# Altium project RCA.PrjPcb
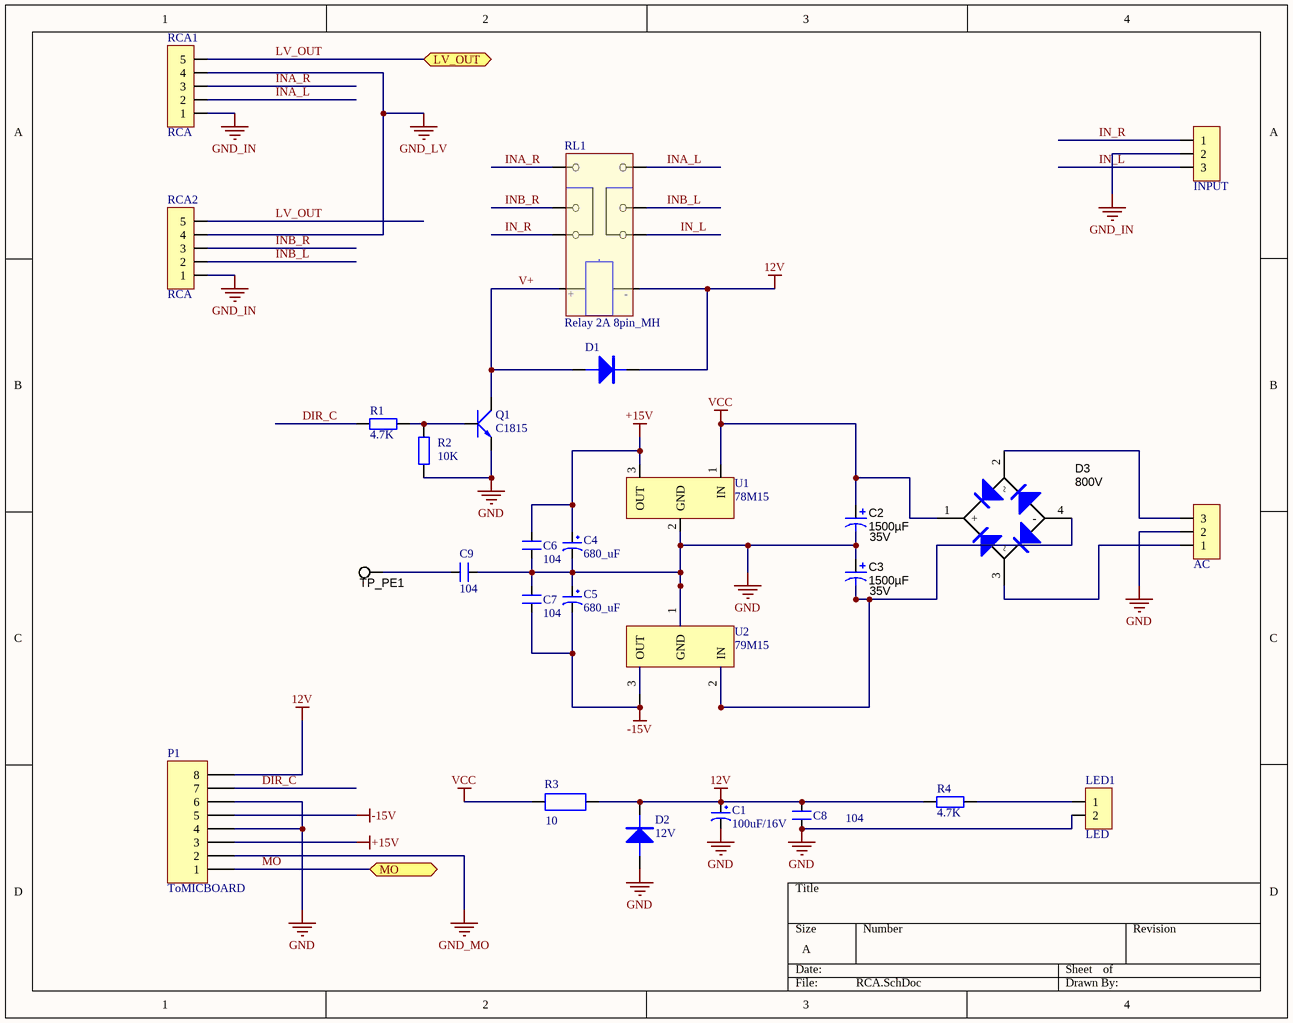
[diagram p0: RCA.SchDoc]
3 sheets, 80 parts. Net scope: flat (ports and power ports of the same name join across sheets).
Board file: PCB1.PcbDoc
Sheets:
  RCA.SchDoc
  outputmixer.SchDoc
  livestream.SchDoc

## Sheet RCA.SchDoc
size A

### Parts
AC  Header 3_MH  [HEADER 3]  (value not drawn)
C1  100uF/16V  [NHG_1000x2200]
C2  ValueDisplayed: 1500µF  Value2: 35V  [FC_1250x2500]  (hidden comment: ELZA350ELL152MK25S)
C3  ValueDisplayed: 1500µF  Value2: 35V  [FC_1250x2500]  (hidden comment: ELZA350ELL152MK25S)
C4  680_uF  [NHG_1000x2200]
C5  680_uF  [NHG_1000x2200]
C6  104  [TU_GOM(104-->105pF)]
C7  104  [TU_GOM(104-->105pF)]
C8  104  [TU_GOM(104-->105pF)]
C9  104  [TU_GOM(104-->105pF)]
D1  Diode 1N4001 DO41 1A 50V (DIP)_MH  [SS14]  (value not drawn)
D2  12V  [Diode Zener 1N5359B 5W 24V]
D3  value 800V  [GBU]  (hidden comment: GBU4K-E3/45)
INPUT  Header 3_MH  [HEADER 3]  (value not drawn)
LED1  LED  [HEADER 2]
P1  ToMICBOARD  [HEADER2M_8P]
Q1  C1815  [TO92]
R1  4.7K  [TRO_VACH_ 1/4W]
R2  10K  [TRO_VACH_ 1/4W]
R3  value 10  [TRO_VACH_2W]  (hidden comment: TRO_CS_2W_MH)
R4  4.7K  [TRO_VACH_ 1/4W]
RCA1  RCA  [RCA3P]
RCA2  RCA  [RCA3P]
RL1  Relay 2A 8pin_MH  [RY-12W-K 12V]
TP_PE1  5012  [Keystone5012]  (value not drawn)
U1  78M15  [TO-220AB]
U2  79M15  [TO-220AB]

### Ports
LV_OUT, MO

### Nets
12V: C1.1 C8.2 D1.2 D2.2 P1.8 R3.2 R4.1 RL1.2
+15V: C4.1 C6.2 P1.3 U1.3(OUT)
-15V: C5.2 C7.1 P1.5 U2.3(OUT)
GND: AC.2 C1.2 C2.2(-) C3.1(+) C4.2 C5.1 C6.1 C7.2 C8.1 C9.1 D2.1 LED1.2 P1.4 P1.6 Q1.1(E) R2.1 RCA1.4 RCA2.4 U1.2(GND) U2.1(GND)  [also labelled GND_LV]
GND_IN: INPUT.2 RCA1.1 RCA2.1
GND_MO: P1.2
VCC: C2.1(+) D3.1(+) R3.1 U1.1(IN)
DIR_C: P1.7 R1.1
IN_L: INPUT.3 RL1.4
IN_R: INPUT.1 RL1.3
INA_L: RCA1.2 RL1.8
INA_R: RCA1.3 RL1.7
INB_L: RCA2.2 RL1.6
INB_R: RCA2.3 RL1.5
LV_OUT: RCA1.5 RCA2.5 ; port LV_OUT
MO: P1.1 ; port MO
V+: D1.1 Q1.2(C) RL1.1
NetAC_1: AC.1 D3.3
NetAC_3: AC.3 D3.2
NetC3_2: C3.2(-) D3.4(-) U2.2(IN)
NetC9_2: C9.2 TP_PE1.1
NetLED1_1: LED1.1 R4.2
NetQ1_3: Q1.3(B) R1.2 R2.2

### Notes on the sheet
- (in symbol Relay 2A 8pin_MH) +; -

### Library data of the parts
AC INPUT = Header 3_MH: Header 3P XH2.54 thẳng
C1 = TU_HOA_100uF_16V_MH: TU_HOA_100uF_16V; Value: 100uF/35V/50V; Description 1: 1000uF/6,3V - 470uF/16V - 330uF - 25V; Description 2: 220uF/35V - 100uF/50V - 63V - 4,7uF/200V; Description 3: 22uF => 33uF100V - 3,3uF => 4,7uF/250V; Description 4: 2,2uF =>3,3uF/350 - 2,2uF/400V - 1uF/450V
C2 C3 = EEU-FC1H561: CAP ALUM 1500UF 20% 35V RADIAL; Manufacturer: Panasonic; Polarized: Y; CompType: Capacitor; U/M: EA; Cap_F: 0.00056; Tolerance_%: 20; Value1: 0.05 ohm; VDC_V: 35; ESR_ohm: 0.05; IRMS_A: 1.832; TaMin_C: -55; TaMax_C: 105; Cap_Case: 12.5x25mm; SymbolVersion: 2008-07-09; Value: 1500uF; PartNumber: ELZA350ELL152MK25S; PackageReference: D12.5xL25mm; RoHS: Y; MountType: TH; Technology: AL; Series: FC; Publisher: Texas Instruments; LatestRevisionDate: 2015-07-24; ComponentLink1Description: Datasheet link; ComponentLink1URL: http://industrial.panasonic.com/lecs/www-data/pdf/ABA0000/ABA0000CE22.pdf; Supplier 1: Digi-Key; Supplier 2: Mouser; Supplier Part Number 2: 565-3374-ND
C4 C5 = TU_HOA_680_uF_25V_MH: TU_HOA_680_uF_25V; Value: 100uF/35V/50V; Description 1: 1000uF/6,3V - 470uF/16V - 330uF - 25V; Description 2: 220uF/35V - 100uF/50V - 63V - 4,7uF/200V; Description 3: 22uF => 33uF100V - 3,3uF => 4,7uF/250V; Description 4: 2,2uF =>3,3uF/350 - 2,2uF/400V - 1uF/450V
C6-C9 = TU_MICA_ 104 100V(2A104J)_MH: Value: 0.1uF
D1 = Diode 1N4001 DO41 1A 50V (DIP)_MH: Diode 1N4001 DO41 1A 50V (DIP)
D2 = Diode 1N4148 DO35 450mA 100V ( 1N4148 DIP)_MH: Diode 1N4148 DO35 450mA 100V ( 1N4148 DIP)
D3 = GBU4K-E3/45: Diode, Switching-Bridge, 800V, 4A, TH; Manufacturer: Vishay-Semiconductor; U/M: EA; Vf_V: 1; Value2: 1V; Io_A: 4; Vr_V: 800; TJmax_C: 150; RJC_CperW: 4.2; RoHS: Y; Supplier 1: Digi-Key; PackageReference: GBU; Type: Switching-Bridge; Supplier Part Number 1: GBU4K-E3/45GI-ND; MountType: TH; PartNumber: GBU4K-E3/45; CompType: Diode; SymbolVersion: 2009-10-05; Value1: 4A; Published: 2008-06-26; Publisher: Texas Instruments; LatestRevisionDate: 2013-12-05; ComponentLink1Description: Datasheet link; ComponentLink1URL: http://www.vishay.com/docs/88614/gbu4a.pdf; Supplier 2: Mouser; Supplier Part Number 2: 625-GBU4K-E3; Supplier 3: Farnell; Supplier Part Number 3: 9549463
LED1 = Header 2_MH: Header 2P XH2.54 thẳng
P1 = Header 8: Header, 8-Pin; LatestRevisionDate: 17-Jul-2002; LatestRevisionNote: Re-released for DXP Platform.; Publisher: Altium Limited
Q1 = C1815 TO92 TRANS NPN 0.15A 50V (DIP)_MH
R1 R2 R4 = TRO_VACH_1/2W_MH: Resistor; Value: 1K; Published: 8-Jun-2000; LatestRevisionDate: 17-Jul-2002; LatestRevisionNote: Re-released for DXP Platform.; Publisher: Altium Limited
RCA1 RCA2 = Header 5_MH: Header 5P XH2.54 thẳng
RL1 = Relay 2A 8pin_MH: rele 2A
TP_PE1 = 5012: Test Point, Multipurpose, White, TH; Manufacturer: Keystone; CompType: Test Point Loop; ContactFinish: Silver; SymbolVersion: 2008-04-04; PartNumber: 5012; PackageReference: White Multipurpose Testpoint; RoHS: Y; MountType: TH; ComponentLink1Description: Datasheet URL; ComponentLink1URL: http://www.keyelco.com/userAssets/file/M60-2p60.pdf; Color: White; Publisher: Texas Instruments; LatestRevisionDate: 2017-01-19; Supplier 1: Digi-Key; Supplier Part Number 1: 36-5012-ND; Supplier 2: Mouser; Supplier Part Number 2: 534-5012
U1 = 78M12: 78M12 TO252_MH
U2 = 7915: 78M12 TO252_MH

## Sheet outputmixer.SchDoc
size A
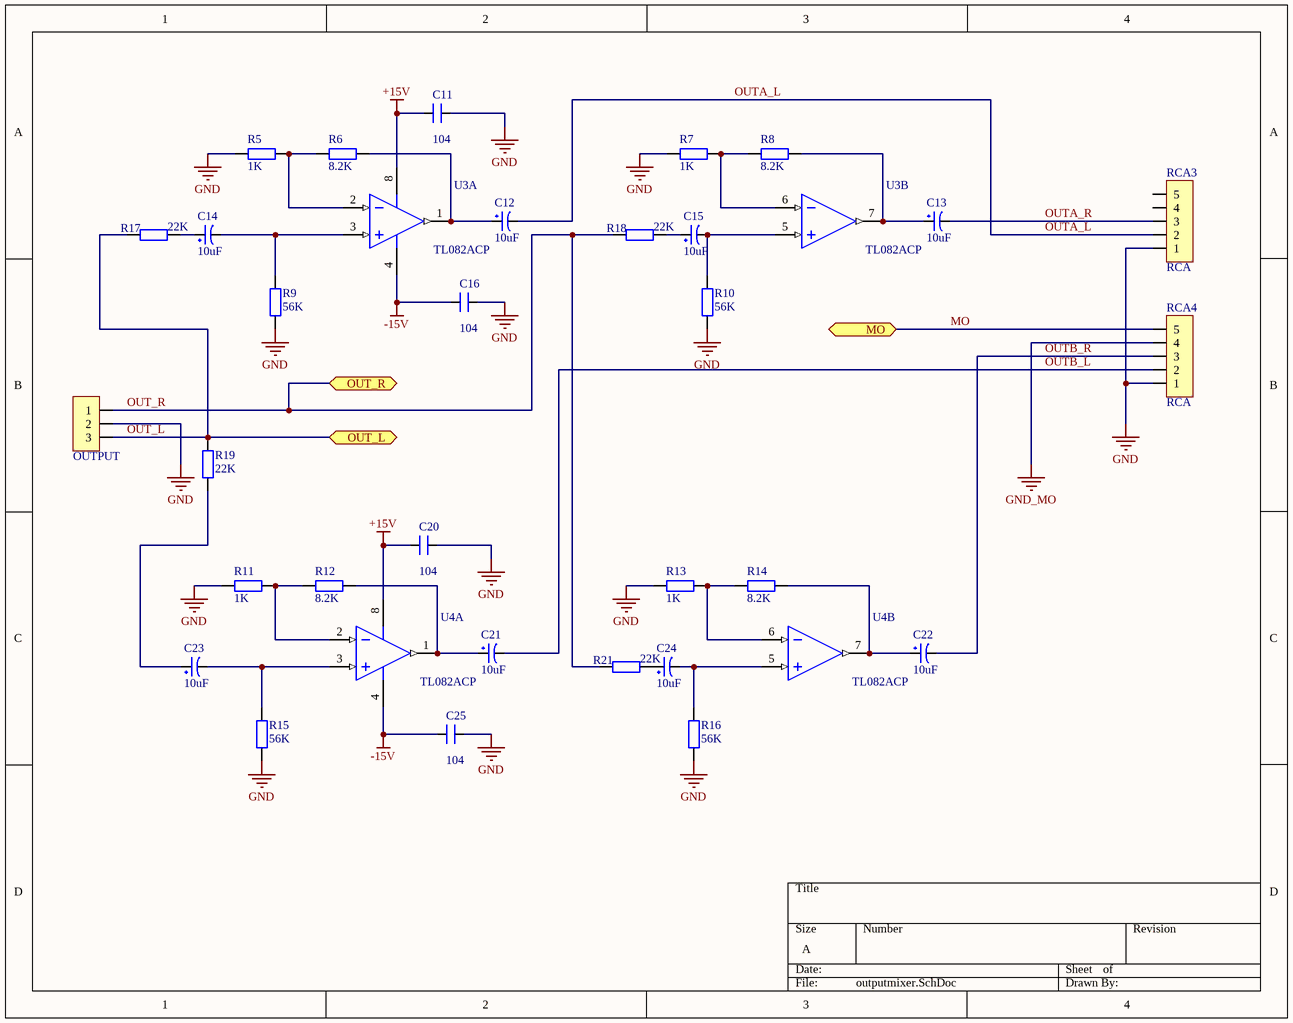
[diagram p1: outputmixer.SchDoc]

### Parts
C11  104  [TU_GOM(104-->105pF)]
C12  10uF  [CAP5x12]
C13  10uF  [CAP5x12]
C14  10uF  [CAP5x12]
C15  10uF  [CAP5x12]
C16  104  [TU_GOM(104-->105pF)]
C20  104  [TU_GOM(104-->105pF)]
C21  10uF  [CAP5x12]
C22  10uF  [CAP5x12]
C23  10uF  [CAP5x12]
C24  10uF  [CAP5x12]
C25  104  [TU_GOM(104-->105pF)]
OUTPUT  Header 3_MH  [HEADER 3]  (value not drawn)
R5  1K  [TRO_VACH_ 1/4W]
R6  8.2K  [TRO_VACH_ 1/4W]
R7  1K  [TRO_VACH_ 1/4W]
R8  8.2K  [TRO_VACH_ 1/4W]
R9  56K  [TRO_VACH_ 1/4W]
R10  56K  [TRO_VACH_ 1/4W]
R11  1K  [TRO_VACH_ 1/4W]
R12  8.2K  [TRO_VACH_ 1/4W]
R13  1K  [TRO_VACH_ 1/4W]
R14  8.2K  [TRO_VACH_ 1/4W]
R15  56K  [TRO_VACH_ 1/4W]
R16  56K  [TRO_VACH_ 1/4W]
R17  22K  [TRO_VACH_ 1/4W]
R18  22K  [TRO_VACH_ 1/4W]
R19  22K  [TRO_VACH_ 1/4W]
R21  22K  [TRO_VACH_ 1/4W]
RCA3  RCA  [RCA3P]
RCA4  RCA  [RCA3P]
U3  TL082ACP  [DIP8]  (parts A,B of 2)
U4  TL082ACP  [DIP8]  (parts A,B of 2)

### Ports
MO, OUT_L, OUT_R

### Nets
+15V: C11.1 C20.1 U3.8(V+) U4.8(V+)
-15V: C16.1 C25.1 U3.4(V-) U4.4(V-)
GND: C11.2 C16.2 C20.2 C25.2 OUTPUT.2 R5.1 R7.1 R9.1 R10.1 R11.1 R13.1 R15.1 R16.1 RCA3.1 RCA4.1
GND_MO: RCA4.4
MO: RCA4.5 ; port MO
OUT_L: OUTPUT.3 R17.1 R19.2 ; port OUT_L
OUT_R: OUTPUT.1 R18.1 R21.1 ; port OUT_R
OUTA_L: C12.2 RCA3.2
OUTA_R: C13.2 RCA3.3
OUTB_L: C21.2 RCA4.2
OUTB_R: C22.2 RCA4.3
NetC12_1: C12.1 R6.1 U3.1(OUT)
NetC13_1: C13.1 R8.1 U3.7(OUT)
NetC14_1: C14.1 R17.2
NetC14_2: C14.2 R9.2 U3.3(IN+)
NetC15_1: C15.1 R18.2
NetC15_2: C15.2 R10.2 U3.5(IN+)
NetC21_1: C21.1 R12.1 U4.1(OUT)
NetC22_1: C22.1 R14.1 U4.7(OUT)
NetC23_1: C23.1 R19.1
NetC23_2: C23.2 R15.2 U4.3(IN+)
NetC24_1: C24.1 R21.2
NetC24_2: C24.2 R16.2 U4.5(IN+)
NetR5_2: R5.2 R6.2 U3.2(IN-)
NetR7_2: R7.2 R8.2 U3.6(IN-)
NetR11_2: R11.2 R12.2 U4.2(IN-)
NetR13_2: R13.2 R14.2 U4.6(IN-)

Not connected (* = marked no-connect by the designer): RCA3 4 5

### Library data of the parts
C11 C16 C20 C25 = TU_MICA_ 104 100V(2A104J)_MH: Value: 0.1uF
C12 C13 C21 C22 = TU_HOA_4.7uF_100V_MH: Value: 4700uF/50V
C14 C15 C23 C24 = TU_HOA_10uF_16V_MH: Value: 10uF/50V; Description 1: 10 => 220uF/6,3V/10V - 10uF => 100uF/16V; Description 2: 0,1uF => 33uF/50V - 10uF => 22uF/63V; Description 3: 0,47uF => 10uF/100V
OUTPUT = Header 3_MH: Header 3P XH2.54 thẳng
R5-R19 R21 = TRO_VACH_1/4W_MH
RCA3 RCA4 = Header 5_MH: Header 5P XH2.54 thẳng
U3 U4 = TL082ACP: JFET-Input Operational Amplifier; Published: 17-Jul-2002; LatestRevisionDate: 06-Jun-2005; LatestRevisionNote: Stylized 3D Model Added.; DatasheetVersion: 1988; PackageReference: 626-05; Publisher: Altium Limited; PackageDescription: DIP; 8 Leads; Row Spacing 7.62 mm; Pitch 2.54 mm; ComponentLink1Description: Manufacturer Link; ComponentLink1URL: http://www.onsemi.com/site/products/parametrics/0,4446,251,00.html

## Sheet livestream.SchDoc
size A
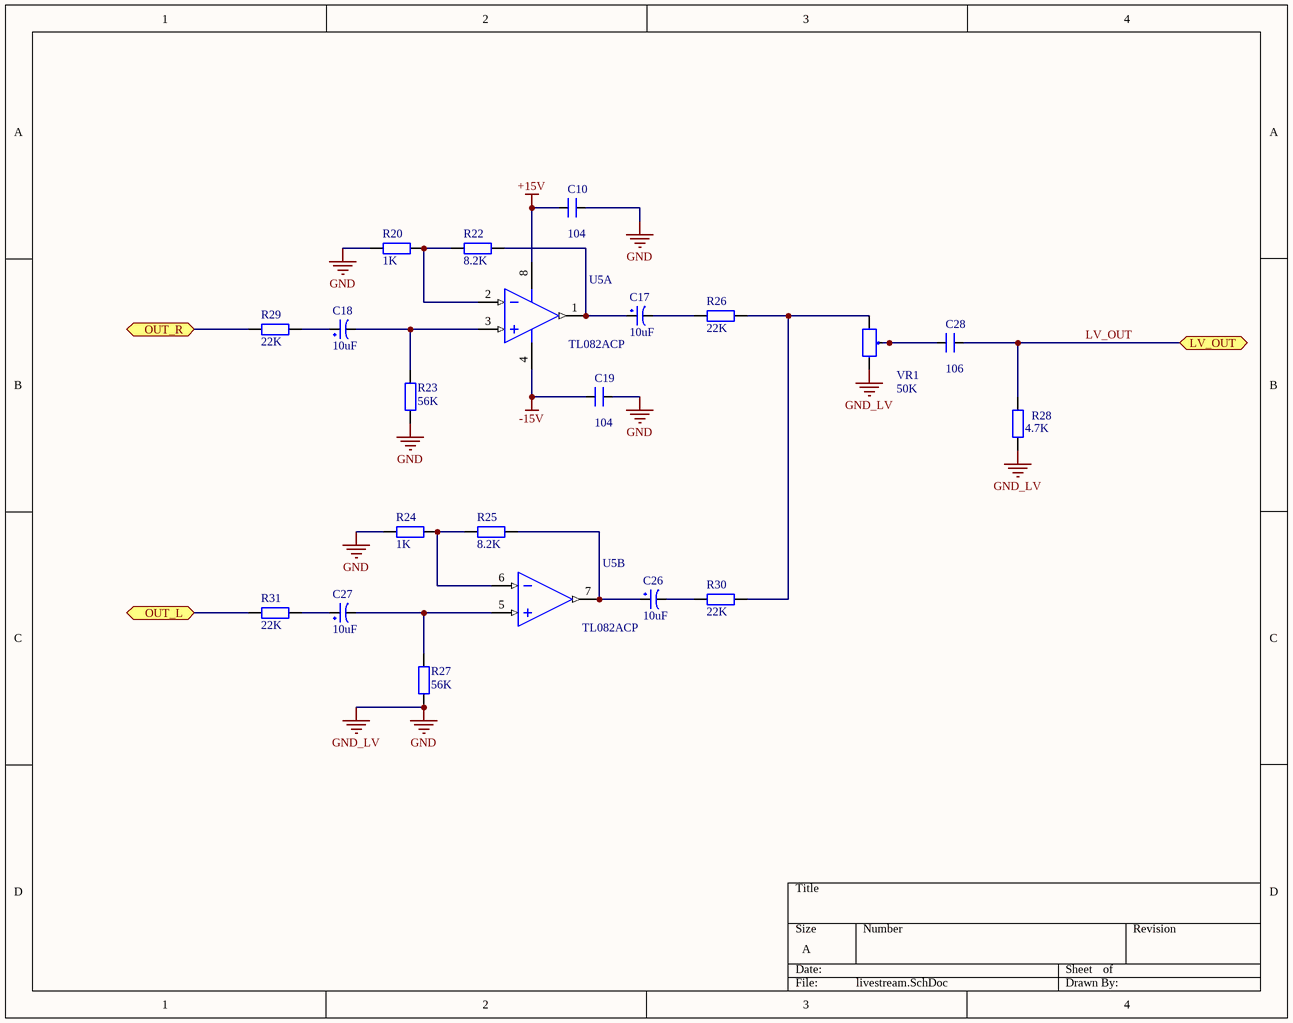
[diagram p2: livestream.SchDoc]

### Parts
C10  104  [0805_HV]
C17  10uF  [0805_HV]
C18  10uF  [0805_HV]
C19  104  [0805_HV]
C26  10uF  [0805_HV]
C27  10uF  [0805_HV]
C28  106  [0805_HV]
R20  1K  [0805_HV]
R22  8.2K  [0805_HV]
R23  56K  [0805_HV]
R24  1K  [0805_HV]
R25  8.2K  [0805_HV]
R26  22K  [0805_HV]
R27  56K  [0805_HV]
R28  4.7K  [0805_HV]
R29  22K  [0805_HV]
R30  22K  [0805_HV]
R31  22K  [0805_HV]
U5  TL082ACP  [SOP 8]  (parts A,B of 2)
VR1  50K  [VR-3V]

### Ports
LV_OUT, OUT_L, OUT_R

### Nets
+15V: C10.1 U5.8(V+)
-15V: C19.1 U5.4(V-)
GND: C10.2 C19.2 R20.1 R23.1 R24.1 R27.1 R28.2 VR1.3  [also labelled GND_LV]
LV_OUT: C28.2 R28.1 ; port LV_OUT
OUT_L: R31.1 ; port OUT_L
OUT_R: R29.1 ; port OUT_R
NetC17_1: C17.1 R22.1 U5.1(OUT)
NetC17_2: C17.2 R26.1
NetC18_1: C18.1 R29.2
NetC18_2: C18.2 R23.2 U5.3(IN+)
NetC26_1: C26.1 R25.1 U5.7(OUT)
NetC26_2: C26.2 R30.1
NetC27_1: C27.1 R31.2
NetC27_2: C27.2 R27.2 U5.5(IN+)
NetC28_1: C28.1 VR1.2
NetR20_2: R20.2 R22.2 U5.2(IN-)
NetR24_2: R24.2 R25.2 U5.6(IN-)
NetR26_2: R26.2 R30.2 VR1.1

### Library data of the parts
C10 C19 C28 = TU_MICA_ 104 100V(2A104J)_MH: Value: 0.1uF
C17 C26 = TU_HOA_4.7uF_100V_MH: Value: 4700uF/50V
C18 C27 = TU_HOA_10uF_16V_MH: as C14 on sheet outputmixer
R20 R22-R31 = TRO_VACH_1/4W_MH
U5 = TL082ACP: JFET-Input Operational Amplifier; Published: 17-Jul-2002; LatestRevisionDate: 06-Jun-2005; LatestRevisionNote: Stylized 3D Model Added.; DatasheetVersion: 1988; PackageReference: 626-05; Publisher: Altium Limited; PackageDescription: DIP; 8 Leads; Row Spacing 7.62 mm; Pitch 2.54 mm; ComponentLink1Description: Manufacturer Link; ComponentLink1URL: http://www.onsemi.com/site/products/parametrics/0,4446,251,00.html
VR1 = BIEN_TRO_VR 204-200K 3296W_MH: VR-vuong

## Nets that join several sheets
+15V: RCA (C4.1 C6.2 P1.3 U1.3), outputmixer (C11.1 C20.1 U3.8 U4.8), livestream (C10.1 U5.8)
-15V: RCA (C5.2 C7.1 P1.5 U2.3), outputmixer (C16.1 C25.1 U3.4 U4.4), livestream (C19.1 U5.4)
GND: RCA (20 pins), outputmixer (15 pins), livestream (8 pins)
GND_MO: RCA (P1.2), outputmixer (RCA4.4)
LV_OUT: RCA (RCA1.5 RCA2.5), livestream (C28.2 R28.1)
MO: RCA (P1.1), outputmixer (RCA4.5)
OUT_L: outputmixer (OUTPUT.3 R17.1 R19.2), livestream (R31.1)
OUT_R: outputmixer (OUTPUT.1 R18.1 R21.1), livestream (R29.1)